# EAGLE design motor_driver (EAGLE 6.5.0)
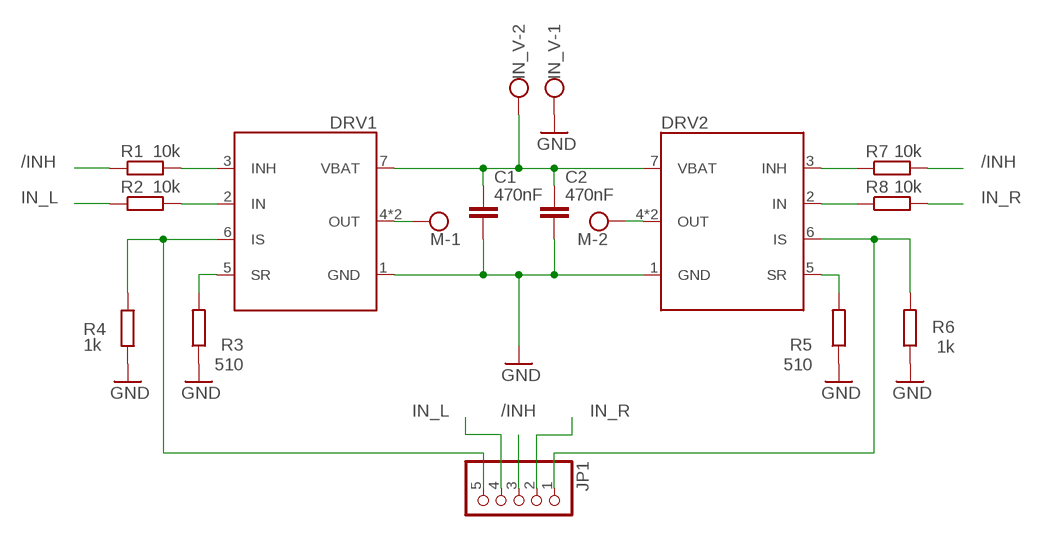
[diagram p0: schematic, sheet 1]

## Parts
C1  470nF  C-EUC0805  [C0805]
C2  470nF  C-EUC0805  [C0805]
DRV1  FAN7093_F085SMD  [TO-263-8]
DRV2  FAN7093_F085SMD  [TO-263-8]
IN_V  W237-102  [W237-102]
JP1  PINHD-1X5  [1X05]
M  W237-102  [W237-102]
R1  10k  R-EU_R0805  [R0805]
R2  10k  R-EU_R0805  [R0805]
R3  510  R-EU_R0805  [R0805]
R4  1k  R-EU_R0805  [R0805]
R5  510  R-EU_R0805  [R0805]
R6  1k  R-EU_R0805  [R0805]
R7  10k  R-EU_R0805  [R0805]
R8  10k  R-EU_R0805  [R0805]

## Nets
/INH: JP1.3 R1.1 R7.2
GND: C1.2 C2.2 DRV1.1(GND) DRV2.1(GND) IN_V.1 R3.1 R4.2 R5.1 R6.1
IN_L: JP1.4 R2.1
IN_R: JP1.2 R8.2
N$1: DRV1.2(IN) R2.2
N$2: DRV1.3(INH) R1.2
N$3: DRV1.5(SR) R3.2
N$5: DRV1.6(IS) JP1.5 R4.1
N$6: DRV1.4(OUT) DRV1.8(OUT) M.1
N$7: DRV2.4(OUT) DRV2.8(OUT) M.2
N$8: DRV2.5(SR) R5.2
N$10: DRV2.6(IS) JP1.1 R6.2
N$11: DRV2.2(IN) R8.1
N$12: DRV2.3(INH) R7.1
VSS: C1.1 C2.1 DRV1.7(VBAT) DRV2.7(VBAT) IN_V.2

## Library data of the parts
C1 C2 = rcl:C-EU: CAPACITOR, European symbol
DRV1 DRV2 = rvp:FAN7093_F085
IN_V M = con-wago-500:W237-102: WAGO SCREW CLAMP; MPN: 237-102; OC_FARNELL: unknown; OC_NEWARK: 70K9898
JP1 = pinhead:PINHD-1X5: PIN HEADER
R1-R8 = resistor:R-EU_: RESISTOR, European symbol

## Board
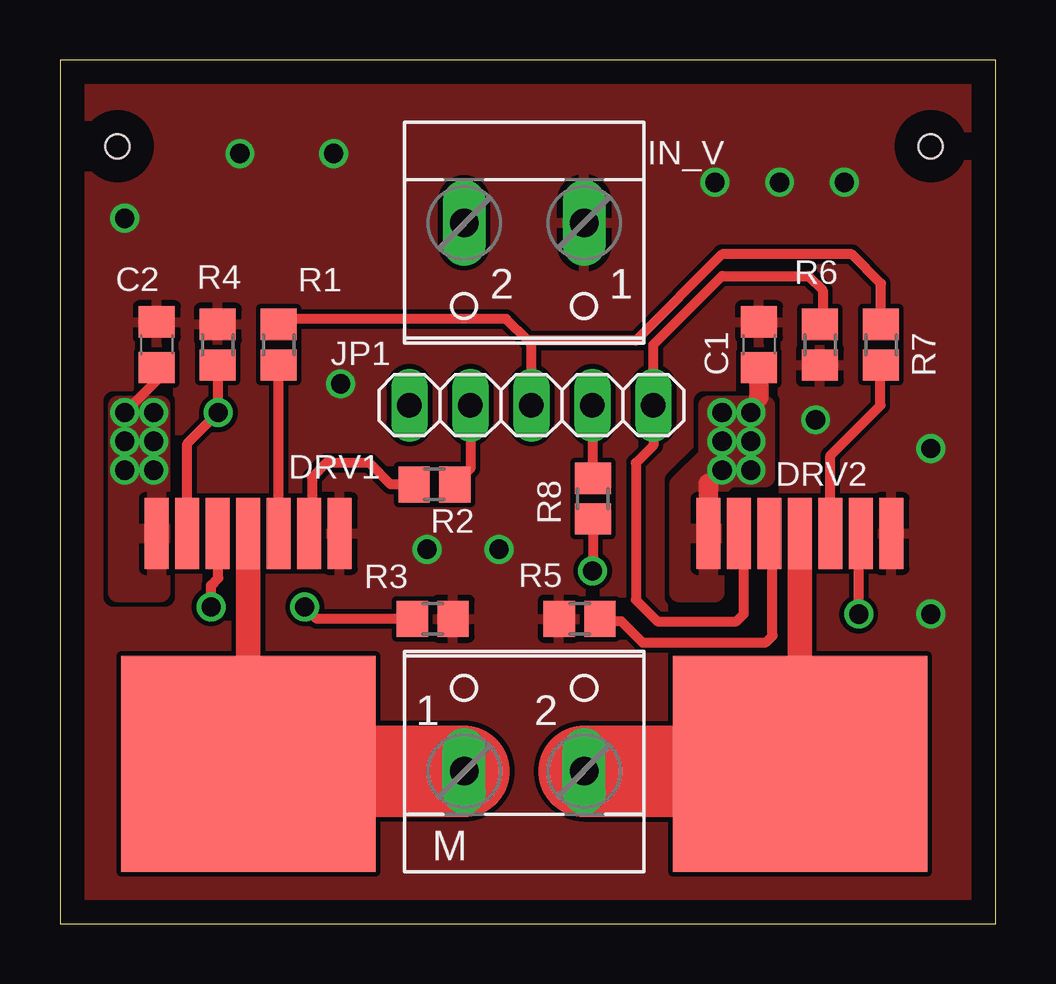
[diagram p1: board, top side]
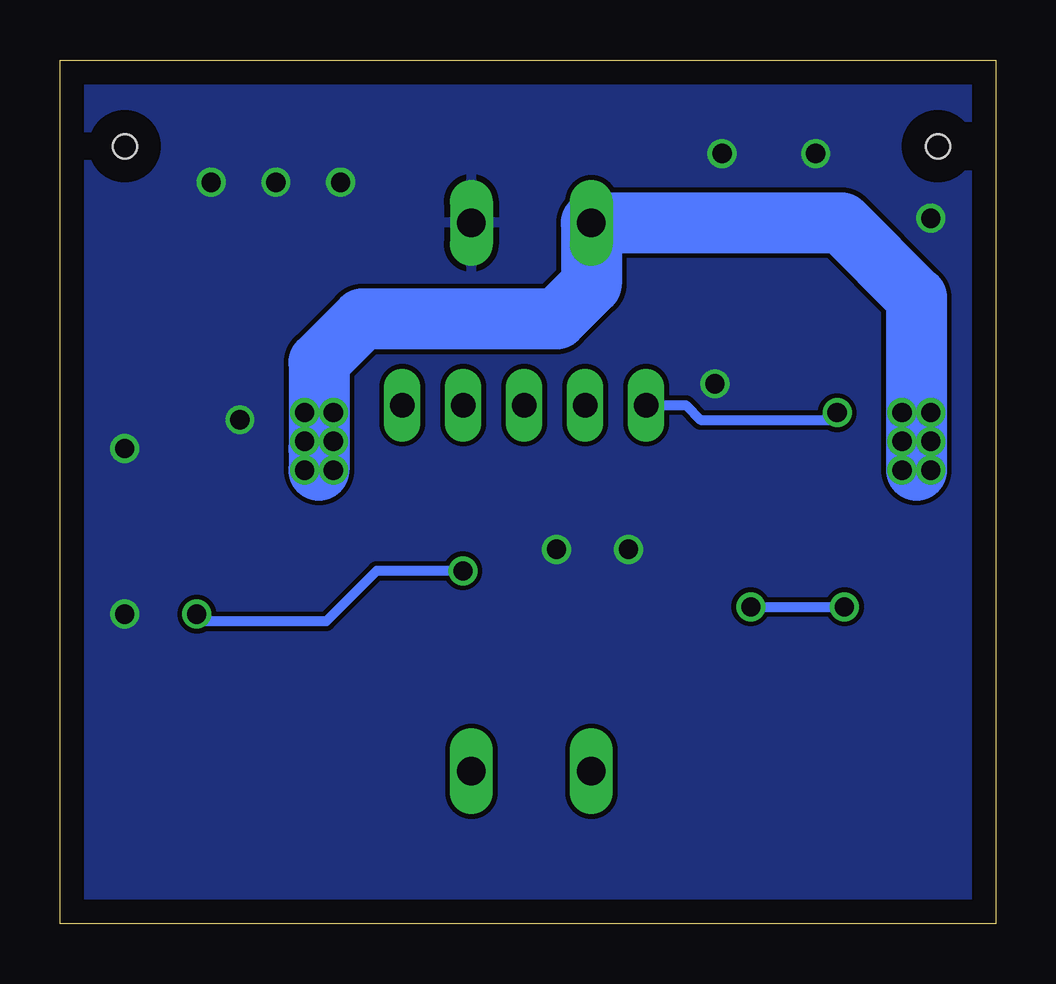
[diagram p2: board, bottom side, seen from below]

Size 39 x 36 mm. Coordinates in mm from the lower left corner, seen from the top.
Outline: 0,0 39,0 39,36 0,36 0,0
Copper layers (1*16): Top 0.035mm / dielectric 1.5mm / Bottom 0.035mm
Design rules "default *": minimum track width 0.3mm, minimum drill 0.6mm, track to track 0.2mm, track to pad 0.2mm, pad to pad 0.2mm, via to via 0.3mm, smd to smd 0mil, copper to edge 1mm, drill to drill 0.3mm, minimum pad ring 10mil, minimum via ring 8mil, stop-mask expansion 4mil, vias tented up to drill 0mil, thermal gap 10mil
Holes 1 mm at 2.4,32.4 36.3,32.4

### Footprints (pad centres in the part's own frame; a part is rotated, then mirrored left to right if it is on the bottom)
C0805 = smd 1.3 x 1.5: 1 -0.95,0; 2 0.95,0
TO-263-8 = smd 1 x 2.95: 1 -3.81,-9.61; 2 -2.54,-9.61; 3 -1.27,-9.61; 4 0,-9.61; 5 1.27,-9.61; 6 2.54,-9.61; 7 3.81,-9.61 | smd 10.6 x 9: 8 0,0
W237-102 = drill 1.194 long: 1 -2.5,-1.27; 2 2.5,-1.27
1X05 = drill 1.016 long: 1 -5.08,0; 2 -2.54,0; 3 0,0; 4 2.54,0; 5 5.08,0
R0805 = smd 1.3 x 1.5: 1 -0.85,0; 2 0.85,0

### Placement (x,y rotation side)
C1  29.14,24.13 90 top
C2  4.04,24.13 90 top
DRV1  7.85,6.65 180 top
DRV2  30.85,6.65 180 top
IN_V  19.35,27.94 180 top
JP1  19.65,21.61 180 top
M  19.35,7.62 0 top
R1  9.12,24.13 270 top
R2  15.61,18.31 180 top
R3  15.54,12.7 180 top
R4  6.58,24.13 90 top
R5  21.66,12.7 0 top
R6  31.68,24.13 90 top
R7  34.22,24.13 90 top
R8  22.21,17.71 90 top

### Tracks (layer width: path | path; a pad name or v marks a point on that pad's centre or on a via)
/INH
  Top 0.406: JP1.3 19.65,24.15 19.5,24.3 | 19.5,24.3 18.6,25.2 9.34,25.2 R1.1 | R7.2 34.22,26.68 33,27.9 27.6,27.9 24,24.3 19.5,24.3
GND  (via drill 0.8)
  other vias: 31.5,21 15.3,15.6 18.3,15.6 7.5,32.1 11.4,32.1 27.3,30.9 30,30.9 32.7,30.9 2.7,29.4 36.3,19.8 11.7,22.5 36.3,12.9
  pour Top (rank 3): 0,36 0,0 39,0 39,36
  pour Bottom (rank 3): 0,36 0,0 39,0 39,36
IN_L
  Top 0.406: JP1.4 17.11,18.96 R2.1
IN_R
  Top 0.406: R8.2 22.21,21.59 JP1.2
N$1
  Top 0.406: R2.2 13.79,18.31 12.9,19.2 11.1,19.2 10.5,18.6 10.5,16.37 DRV1.2
N$2
  Top 0.406: DRV1.3 R1.2
N$3  (via drill 0.8)
  Top 0.406: R3.2 10.7,12.7 v10.2,13.2 | v6.3,13.2 6.3,14.1 6.6,14.4 6.6,16.24 DRV1.5
  Bottom 0.406: v10.2,13.2 v6.3,13.2
N$5  (via drill 0.8)
  Top 0.406: DRV1.6 5.31,20.01 v6.6,21.3 6.6,23.26 R4.1
  Bottom 0.406: JP1.5 12.91,21.61 12.3,21 6.9,21 v6.6,21.3
N$6
  Top 1.016: DRV1.4 DRV1.8
  Top 3.81: M.1 7.85,6.35 DRV1.8
N$7
  Top 1.016: DRV2.4 DRV2.8
  Top 3.81: M.2 30.85,6.35 DRV2.8
N$8
  Top 0.406: DRV2.5 29.7,16.14 29.7,12 29.4,11.7 24.3,11.7 23.4,12.6 22.61,12.6 R5.2
N$10
  Top 0.406: R6.2 31.8,25.1 31.8,26.4 31.2,27 27.6,27 24.73,24.13 JP1.1 24.73,19.93 24,19.2 24,13.5 24.9,12.6 28.2,12.6 28.5,12.9 28.5,16.07 DRV2.6
N$11  (via drill 0.8)
  Top 0.406: v33.3,12.9 33.3,16.17 DRV2.2 | R8.1 v22.21,14.71 v22.2,14.7
  Bottom 0.406: v22.2,14.7 25.8,14.7 27.9,12.6 33,12.6 v33.3,12.9
N$12
  Top 0.406: DRV2.3 32.12,19.52 34.2,21.6 34.2,23.26 R7.1
VSS  (via drill 0.8)
  Top 0.406: C2.1 4.04,22.64 v2.7,21.3 | 29.14,21.94 29.14,21.64 v28.8,21.3
  Top 0.813: DRV2.7 27.04,18.34 | C1.1 29.14,21.94
  Bottom 0.406: v27.6,20.1 27.9,20.1 28.2,19.8
  Bottom 1.016: v2.7,18.9 3,18.9 3.3,19.2
  Bottom 2.54: 3.3,18.9 3.3,19.2 3.3,26.1 6.41,29.21 IN_V.2 16.85,26.65 18.3,25.2 26.4,25.2 28.2,23.4 28.2,19.8 28.2,18.9
  other vias: 3.9,21.3 27.6,21.3 3.9,18.9 2.7,20.1 3.9,20.1 28.8,20.1 28.8,18.9 27.6,18.9
  pour Top: 4.2,21.6 4.2,13.8 2.4,13.8 2.4,21.6
  pour Top: 29.4,21.6 27,21.6 27,19.5 25.8,18.3 25.8,13.8 27.3,13.8 27.3,18 27.9,18.6 29.4,18.6